# EAGLE design bebox_bnc (EAGLE 9.2.2)
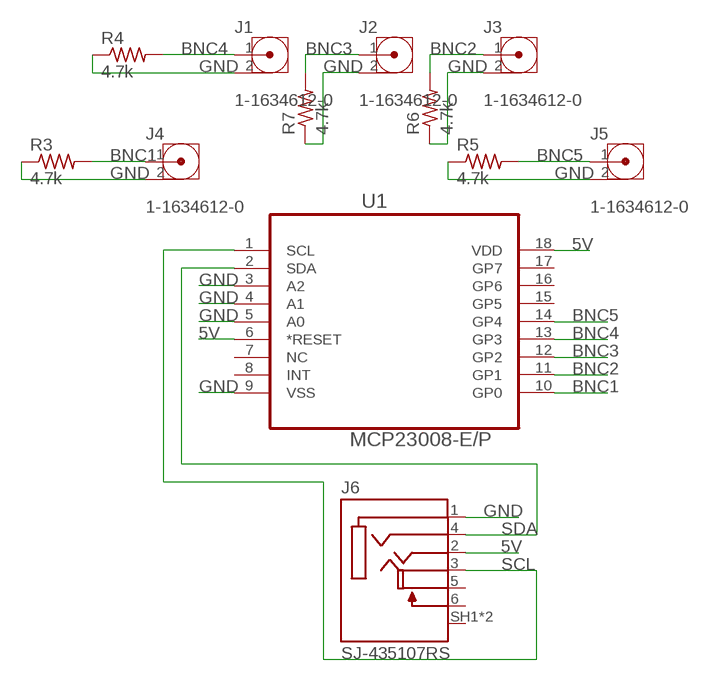
[diagram p0: schematic, sheet 1]

## Parts
J1  1-1634612-0  [TE_1-1634612-0]
J2  1-1634612-0  [TE_1-1634612-0]
J3  1-1634612-0  [TE_1-1634612-0]
J4  1-1634612-0  [TE_1-1634612-0]
J5  1-1634612-0  [TE_1-1634612-0]
J6  SJ-435107RS  [CUI_SJ-435107RS]
R3  4.7k  R-US_0207/10  [0207/10]
R4  4.7k  R-US_0207/10  [0207/10]
R5  4.7k  R-US_0207/10  [0207/10]
R6  4.7k  R-US_0207/10  [0207/10]
R7  4.7k  R-US_0207/10  [0207/10]
U1  MCP23008-E/P  [DIP254P762X533-18]

## Nets
5V: J6.2(TIP) U1.6(*RESET) U1.18(VDD)
BNC1: J4.1 R3.2 U1.10(GP0)
BNC2: J3.1 R6.2 U1.11(GP1)
BNC3: J2.1 R7.2 U1.12(GP2)
BNC4: J1.1 R4.2 U1.13(GP3)
BNC5: J5.1 R5.2 U1.14(GP4)
GND: J1.2 J2.2 J3.2 J4.2 J5.2 J6.1(SLEEVE) R3.1 R4.1 R5.1 R6.1 R7.1 U1.3(A2) U1.4(A1) U1.5(A0) U1.9(VSS)
SCL: J6.3(RING1) U1.1(SCL)
SDA: J6.4(RING2) U1.2(SDA)
Unconnected: J6.5(ISOLATED_RING1) J6.6(ISOLATED_RING1_SWITCH(N-O)) J6.SH1(SHIELD) J6.SH2(SHIELD) U1.7(NC) U1.8(INT) U1.15(GP5) U1.16(GP6) U1.17(GP7)

## Library data of the parts
J1-J5 = 1-1634612-0:1-1634612-0: Conn ZDC/BNC RCP 0Hz to 4GHz 50Ohm Solder RA Thru-Hole Gold Over Nickel Over Copper Loose Piece; COMMENT: 1-1634612-0; DESCRIPTION: BNC Ins R/A PCB Skt 50Ohm Black; DIGI-KEY_PART_NUMBER: A97555-ND; DIGI-KEY_PURCHASE_URL: https://www.digikey.com/product-detail/en/te-connectivity-amp-connectors/1-1634612-0/A97555-ND/1755942?utm_source=snapeda&utm_medium=aggregator&utm_campaign=symbol; EU_ROHS_COMPLIANCE: Compliant; MF: TE Connectivity; MP: 1-1634612-0; NUMBER_OF_POSITIONS: 1; PACKAGE: None; TE_PURCHASE_URL: https://www.te.com/usa-en/product-1-1634612-0.html?te_bu=Cor&te_type=disp&te_campaign=seda_glo_cor-seda-global-disp-prtnr-fy19-seda-model-bom-cta_sma-317_1&elqCampaignId=32493
J6 = SJ-435107RS:SJ-435107RS: 3.5 mm Right Angle Shielded (0.141", 1/8", Mini Plug) Female HeadPhone Jack; AVAILABILITY: Good; DESCRIPTION: 3.5 mm Right Angle Shielded _0.141, 1/8, Mini Plug_ Female HeadPhone Jack; MF: CUI; MP: SJ-435107RS; PACKAGE: None; PRICE: 1.04 USD
R3-R7 = rcl:R-US_: RESISTOR, American symbol; SPICEPREFIX: R
U1 = MCP23008-E_P:MCP23008-E/P: IC I/O EXPANDER I2C 8B; AVAILABILITY: Unavailable; DESCRIPTION: MCP23008 Series 5.5 V 1.7 MHz 8-Bit I/O Expander with Serial Interface - PDIP-18; MF: Microchip; MP: MCP23008-E/P; PACKAGE: PDIP-18 Microchip; PRICE: None

## Board
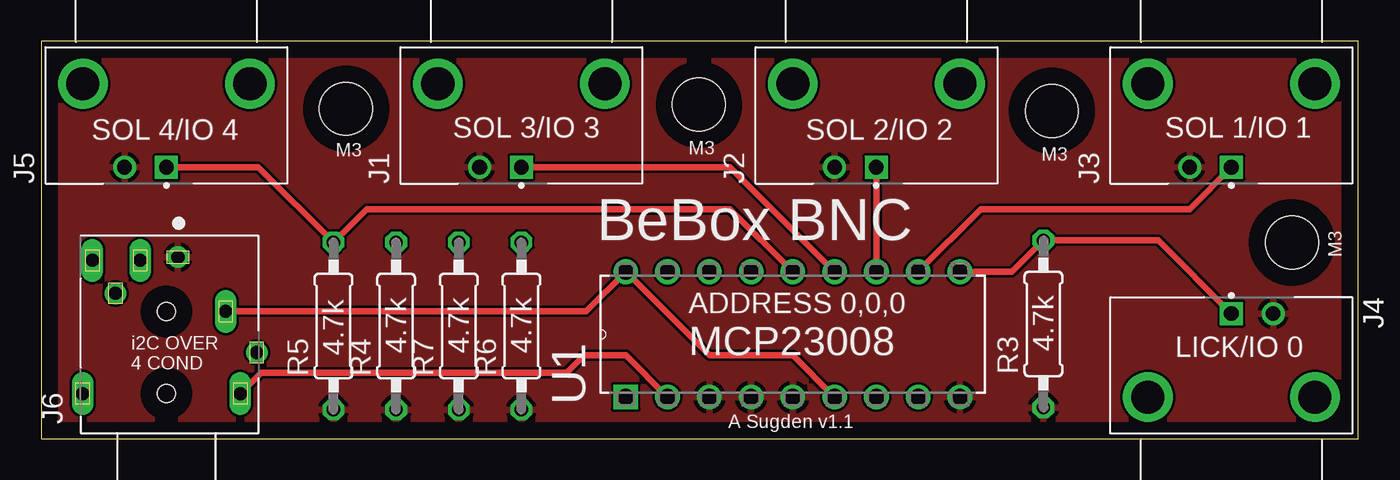
[diagram p1: board, top side]
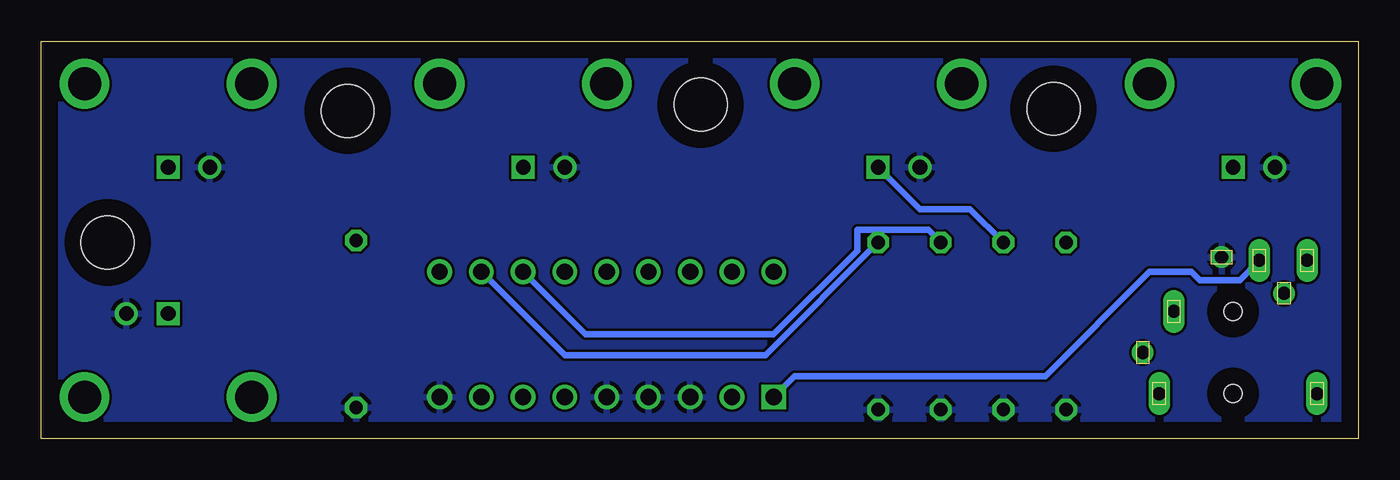
[diagram p2: board, bottom side, seen from below]

Size 80.12 x 24.18 mm. Coordinates in mm from the lower left corner, seen from the top.
Outline: 0,0 80.12,0 80.12,24.18 0,24.18 0,0
Copper layers (1*16): Top 0.035mm / dielectric 1.5mm / Bottom 0.035mm
Design rules "default": minimum track width 6mil, minimum drill 0.35mm, track to track 6mil, track to pad 6mil, pad to pad 6mil, via to via 6mil, smd to smd 6mil, copper to edge 40mil, drill to drill 6mil, minimum pad ring 10mil, minimum via ring 8mil, stop-mask expansion 4mil, vias tented up to drill 0mil, thermal gap 10mil
Holes 3.2 mm at 76.07,11.94 61.47,19.94 40.01,20.32 18.54,20.07

### Footprints (pad centres in the part's own frame; a part is rotated, then mirrored left to right if it is on the bottom)
TE_1-1634612-0 = drill 0.89 square: 1 0,0 | drill 0.89: 2 0,2.54 | drill 2.01: S1 5.08,5.08; S2 5.08,-5.08
CUI_SJ-435107RS = drill 0.8 pad 1.1: 1 4.7,-0.7; 5 2.5,3.1; SH2 -1.1,-5.5 | drill 0.8 pad 1.1 long: 2 1.4,-3.6; 3 4.5,1.6; 4 -3.6,-4.5; 6 4.5,4.5; SH1 -3.6,5.1 | hole 1.1: -3.6,0; 1.4,0
0207/10 = drill 0.813 octagon: 1 -5.08,0; 2 5.08,0
DIP254P762X533-18 = drill 0.991 square: 1 -7.62,20.32 | drill 0.991: 2 -7.62,17.78; 3 -7.62,15.24; 4 -7.62,12.7; 5 -7.62,10.16; 6 -7.62,7.62; 7 -7.62,5.08; 8 -7.62,2.54; 9 -7.62,0; 10 0,0; 11 0,2.54; 12 0,5.08; 13 0,7.62; 14 0,10.16; 15 0,12.7; 16 0,15.24; 17 0,17.78; 18 0,20.32

### Placement (x,y rotation side)
J1  29.21,16.51 90 top
J2  50.8,16.51 90 top
J3  72.39,16.51 90 top
J4  72.39,7.62 270 top
J5  7.62,16.51 90 top
J6  7.62,6.35 90 top
R3  60.96,6.99 90 top
R4  21.59,6.86 90 top
R5  17.78,6.86 90 top
R6  29.21,6.86 90 top
R7  25.4,6.86 90 top
U1  55.88,10.16 90 top

### Tracks (layer width: path | path; a pad name or v marks a point on that pad's centre or on a via)
5V
  Top 0.406: U1.6 45.72,5.08 40.64,5.08 U1.18 33.15,7.75 J6.2
BNC1
  Top 0.406: U1.10 59.05,10.16 R3.2 67.94,12.07 J4.1
BNC2
  Top 0.406: U1.11 57.15,13.97 69.85,13.97 J3.1
  Bottom 0.406: R6.2 36.07,5.08 48.26,5.08 U1.11
BNC3
  Top 0.406: U1.12 J2.1
  Bottom 0.406: U1.12 46.99,6.35 35.56,6.35 30.48,11.43 30.48,12.7 26.16,12.7 R7.2
BNC4
  Top 0.406: U1.13 41.91,16.51 J1.1
  Bottom 0.406: R4.2 23.62,13.97 26.67,13.97 J1.1
BNC5
  Top 0.406: U1.14 41.91,13.97 19.81,13.97 R5.2 13.21,16.51 J5.1
GND
  pour Top: 0,24.13 0,0 80.01,0 80.01,24.13
  pour Bottom: 0,24.13 0,0 80.01,0 80.01,24.13
SCL
  Bottom 0.406: J6.3 7.22,9.65 9.65,9.65 10.16,10.16 12.7,10.16 19.05,3.81 34.29,3.81 U1.1
SDA
  Top 0.406: J6.4 13.39,4.02 31.96,4.02 33.02,5.08 35.56,5.08 U1.2

### Text on the board
tPlace: SOL 4/IO 4 | SOL 3/IO 3 | SOL 2/IO 2 | SOL 1/IO 1 | M3 | M3 | M3 | BeBox BNC | M3 | ADDRESS 0,0,0 | 4.7k | 4.7k | 4.7k | 4.7k | MCP23008 | 4.7k | i2C OVER / 4 COND | LICK/IO 0 | A Sugden v1.1